# EAGLE design can-5-way (EAGLE 6.3)
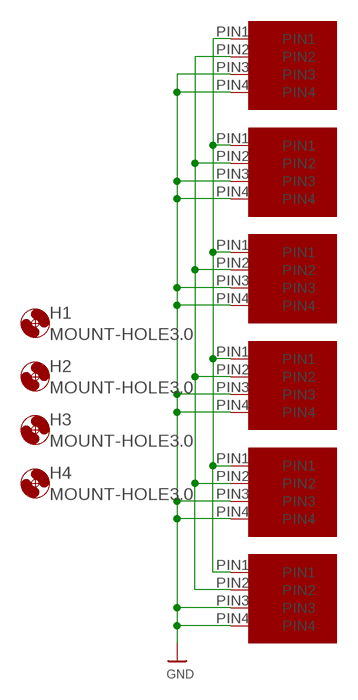
[diagram p0: schematic, sheet 1]

## Parts
H1  MOUNT-HOLE3.0  [3,0]
H2  MOUNT-HOLE3.0  [3,0]
H3  MOUNT-HOLE3.0  [3,0]
H4  MOUNT-HOLE3.0  [3,0]
U$1  MICROFIT4  [MICROFIT4SOCK]
U$2  MICROFIT4  [MICROFIT4SOCK]
U$3  MICROFIT4  [MICROFIT4SOCK]
U$4  MICROFIT4  [MICROFIT4SOCK]
U$5  MICROFIT4  [MICROFIT4SOCK]
U$7  MICROFIT4  [MICROFIT4SOCK]

## Nets
GND: U$1.PIN3 U$1.PIN4 U$2.PIN3 U$2.PIN4 U$3.PIN3 U$3.PIN4 U$4.PIN3 U$4.PIN4 U$5.PIN3 U$5.PIN4 U$7.PIN3 U$7.PIN4
N$1: U$1.PIN1 U$2.PIN1 U$3.PIN1 U$4.PIN1 U$5.PIN1 U$7.PIN1
N$2: U$1.PIN2 U$2.PIN2 U$3.PIN2 U$4.PIN2 U$5.PIN2 U$7.PIN2

## Library data of the parts
H1-H4 = holes:MOUNT-HOLE: MOUNTING HOLE with drill center marker
U$1-U$5 U$7 = unicorn:MICROFIT4

## Board
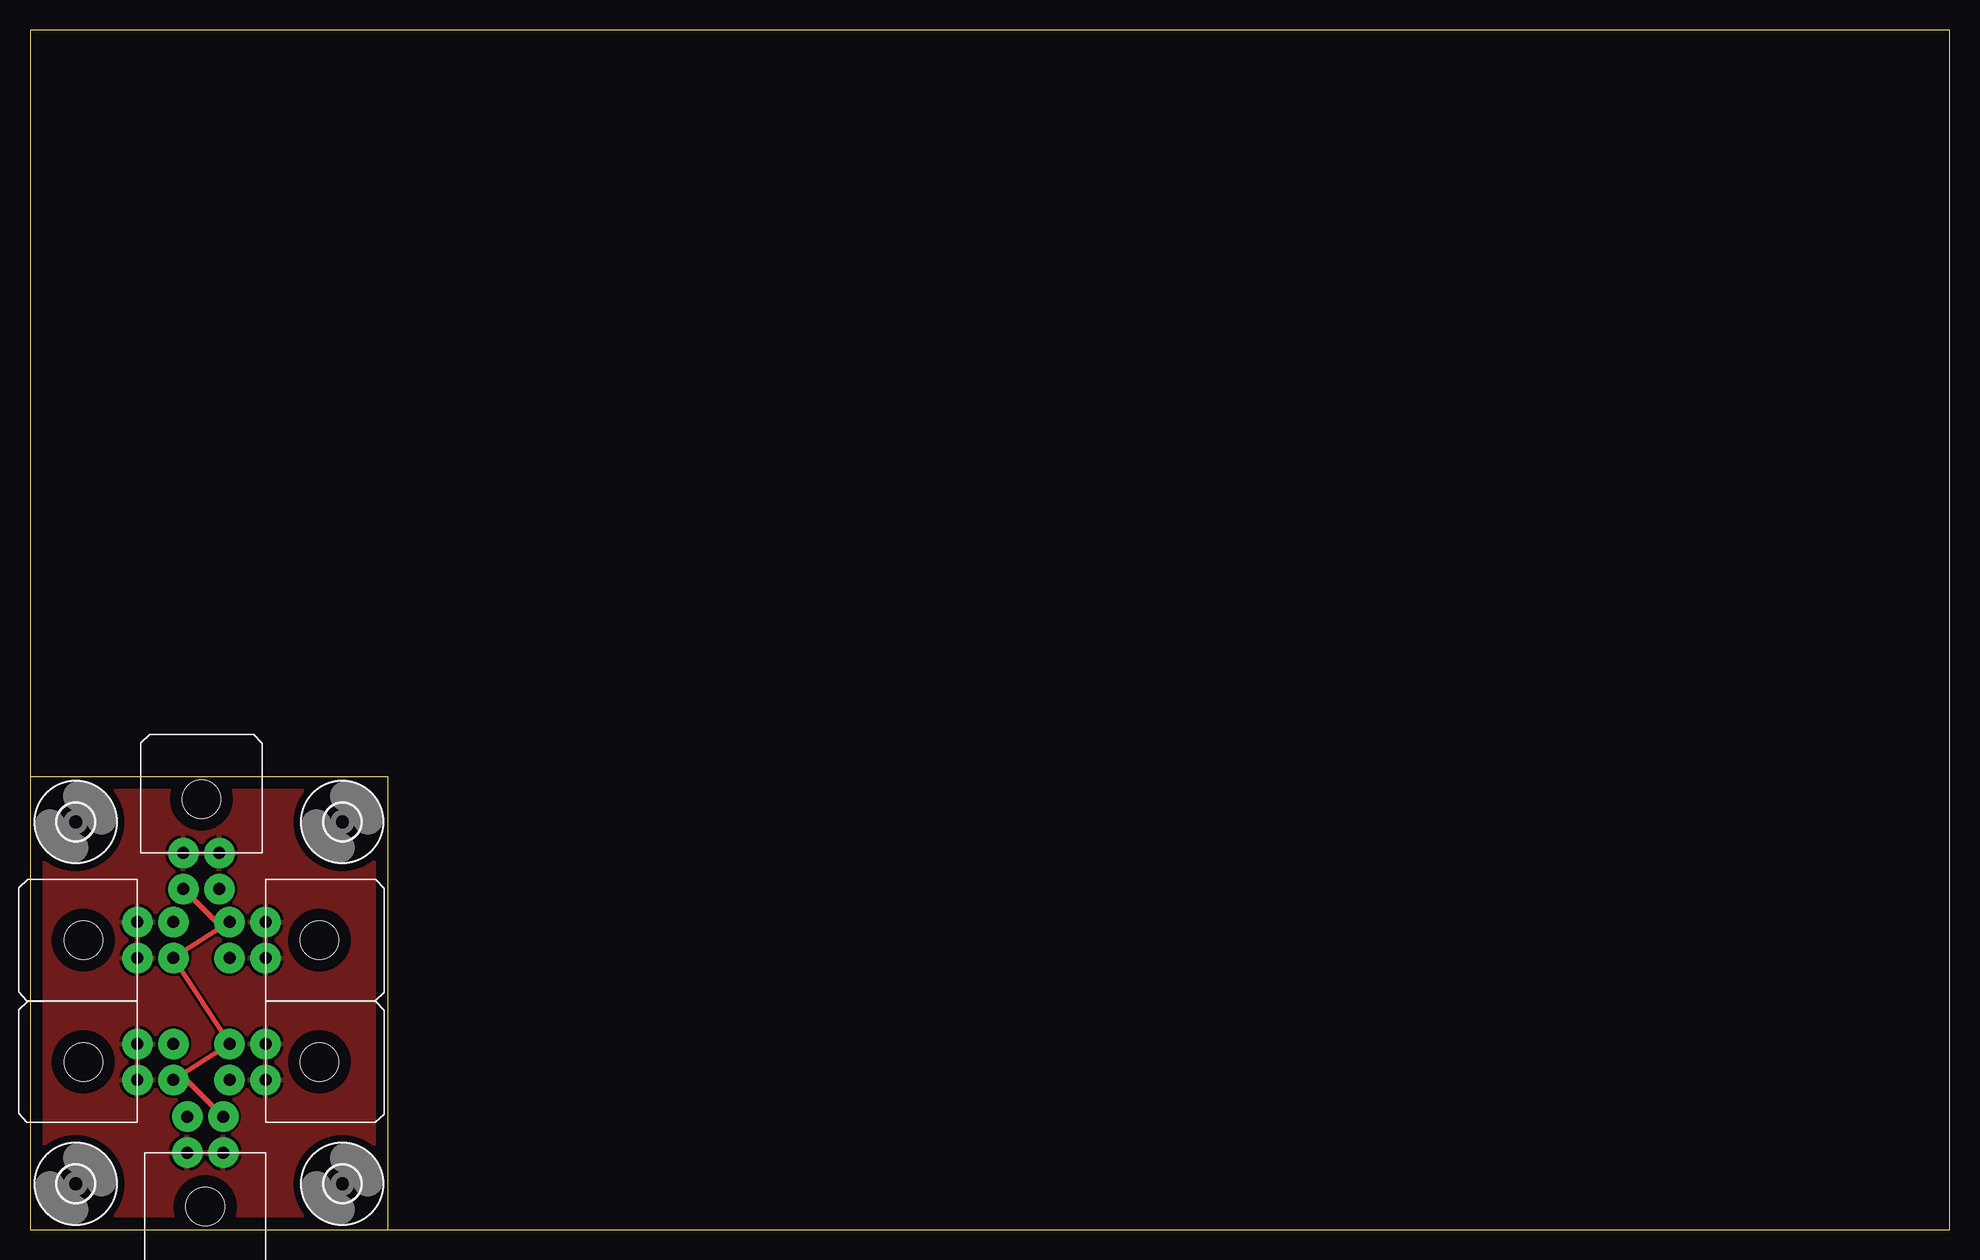
[diagram p1: board, top side]
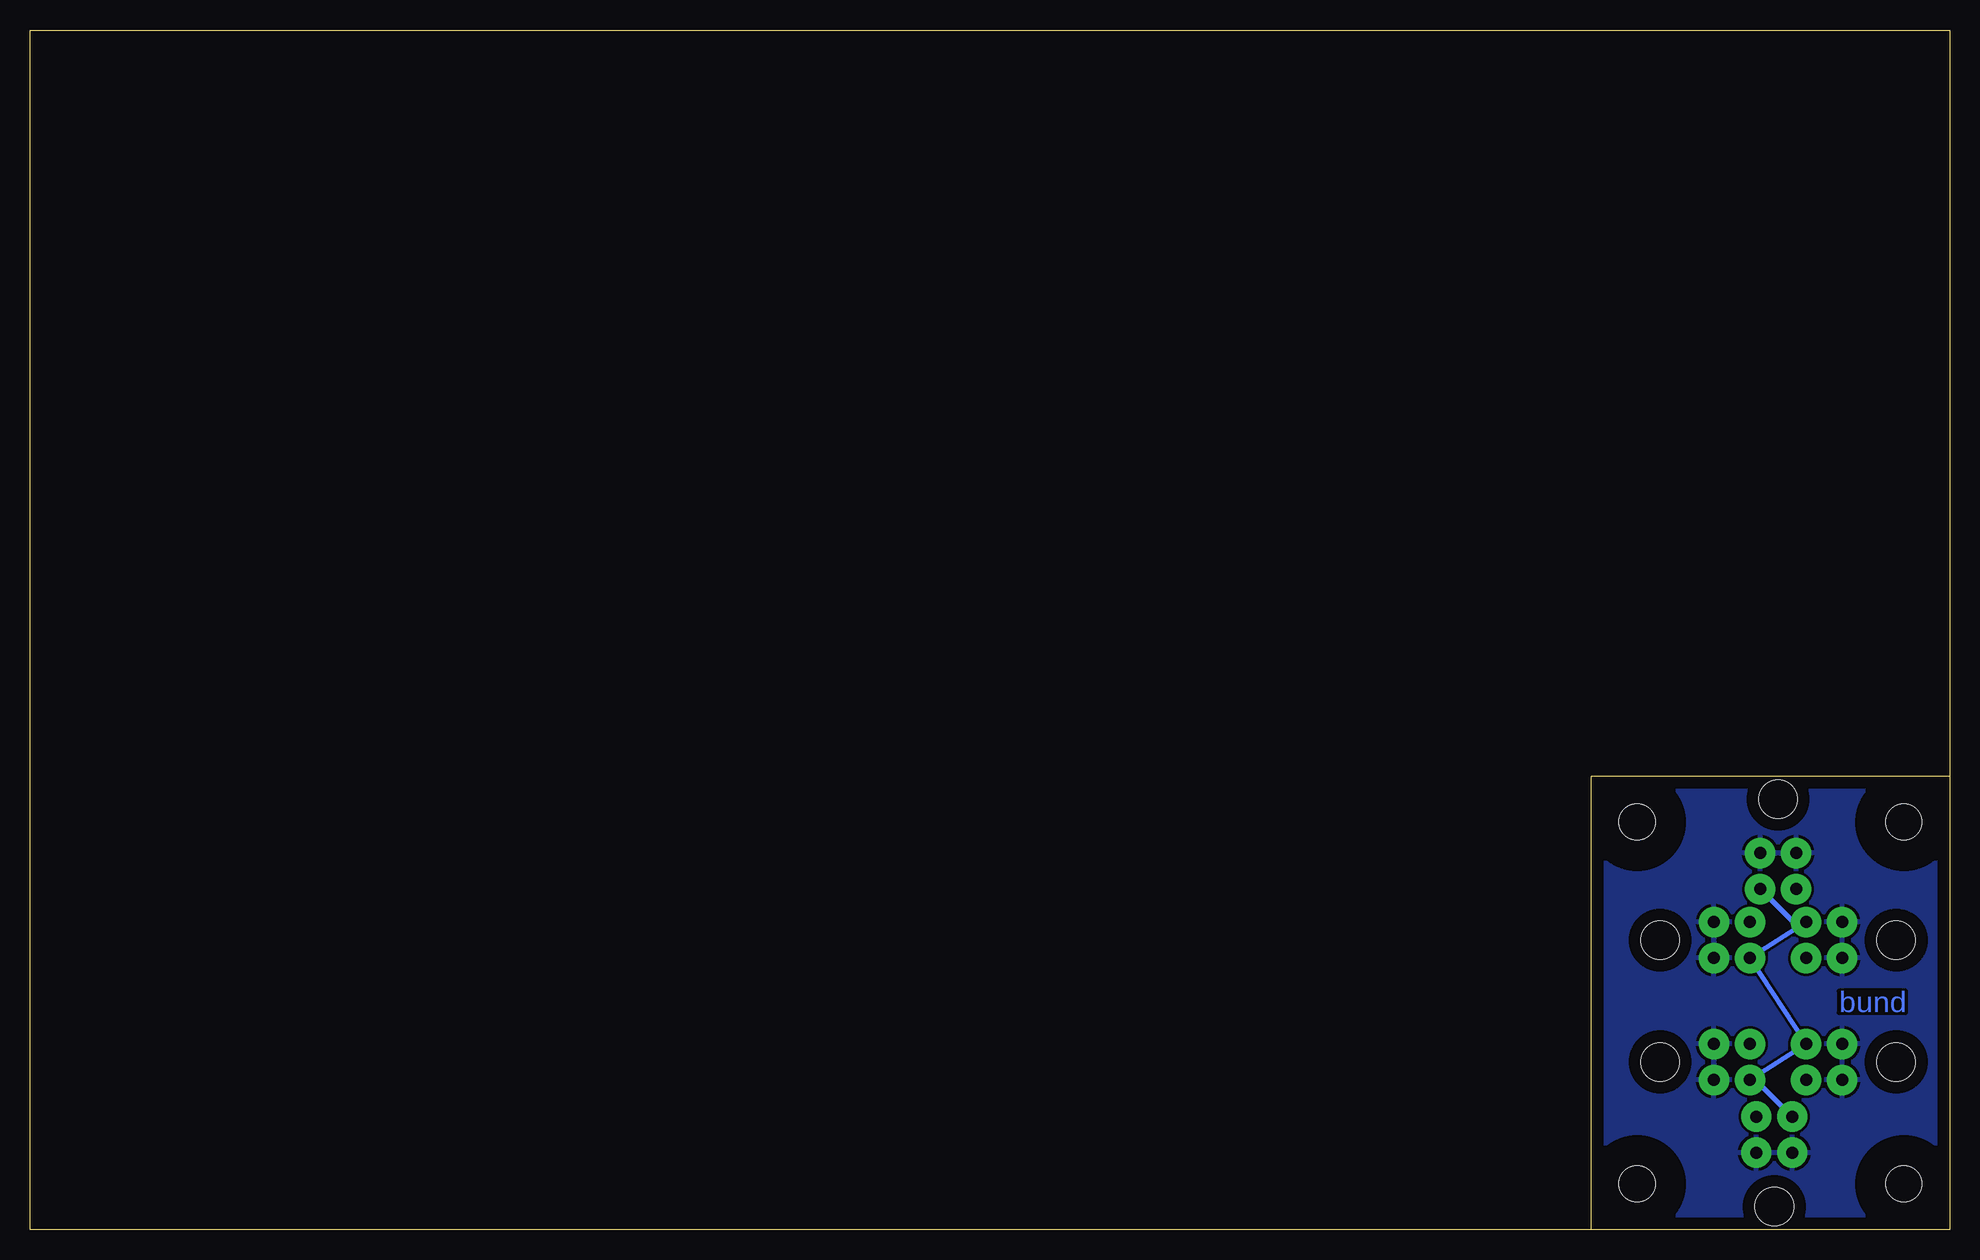
[diagram p2: board, bottom side, seen from below]

Size 160 x 100 mm. Coordinates in mm from the lower left corner, seen from the top.
Outline: 29.84,0 160,0 160,100 0,100 0,37.78
Outline: 29.84,0 0,0 0,37.78
Outline: 29.84,0 29.84,37.78 0,37.78
Copper layers (1*16): Top 0.035mm / dielectric 1.5mm / Bottom 0.035mm
Design rules "default": minimum track width 10mil, minimum drill 24mil, track to track 8mil, track to pad 8mil, pad to pad 8mil, via to via 8mil, smd to smd 8mil, copper to edge 40mil, drill to drill 8mil, minimum pad ring 10mil, minimum via ring 8mil, stop-mask expansion 4mil, vias tented up to drill 0mil, thermal gap 10mil

### Footprints (pad centres in the part's own frame; a part is rotated, then mirrored left to right if it is on the bottom)
3,0 = hole 3: 0,0
MICROFIT4SOCK = drill 1 pad 2.54: PIN1 -1.5,7.5; PIN2 1.5,7.5; PIN3 -1.5,4.5; PIN4 1.5,4.5 | hole 3.2: 0,0

### Placement (x,y rotation side)
H1  26.04,3.81 0 top
H2  3.81,3.81 0 top
H3  26.04,33.97 0 top
H4  3.81,33.97 0 top
U$1  4.45,13.97 270 top
U$2  14.61,1.91 0 top
U$3  24.13,13.97 90 top
U$4  4.45,24.13 270 top
U$5  24.13,24.13 90 top
U$7  14.29,35.88 180 top

### Tracks (layer width: path | path; a pad name or v marks a point on that pad's centre or on a via)
GND
  pour Top: 0,0 29.84,0 29.84,37.78 0,37.78
  pour Bottom: 0,0 29.84,0 29.84,37.78 0,37.78
N$1
  Bottom 0.406: U$2.PIN1 16.17,12.47 U$3.PIN1 U$1.PIN1 U$5.PIN1 U$4.PIN1 13.04,25.63 U$7.PIN1
N$2
  Top 0.406: U$2.PIN2 13.04,12.47 U$1.PIN2 U$3.PIN2 U$4.PIN2 U$5.PIN2 15.54,25.63 U$7.PIN2
N$3  (via drill 0.6)
  other vias: 3.81,33.97
N$4  (via drill 0.6)
  other vias: 26.04,33.97
N$5  (via drill 0.6)
  other vias: 3.81,3.81
N$6  (via drill 0.6)
  other vias: 26.04,3.81
N$7  (via drill 0.6)
  other vias: 14.61,1.91
N$8  (via drill 0.6)
  other vias: 4.45,13.97
N$9  (via drill 0.6)
  other vias: 4.45,24.13
N$10  (via drill 0.6)
  other vias: 14.29,35.88
N$11  (via drill 0.6)
  other vias: 24.13,24.13
N$12  (via drill 0.6)
  other vias: 24.13,13.97

### Text on the board
Bottom: bund